# Altium schematic sheet 25.SchDoc
size 513 x 386 mm
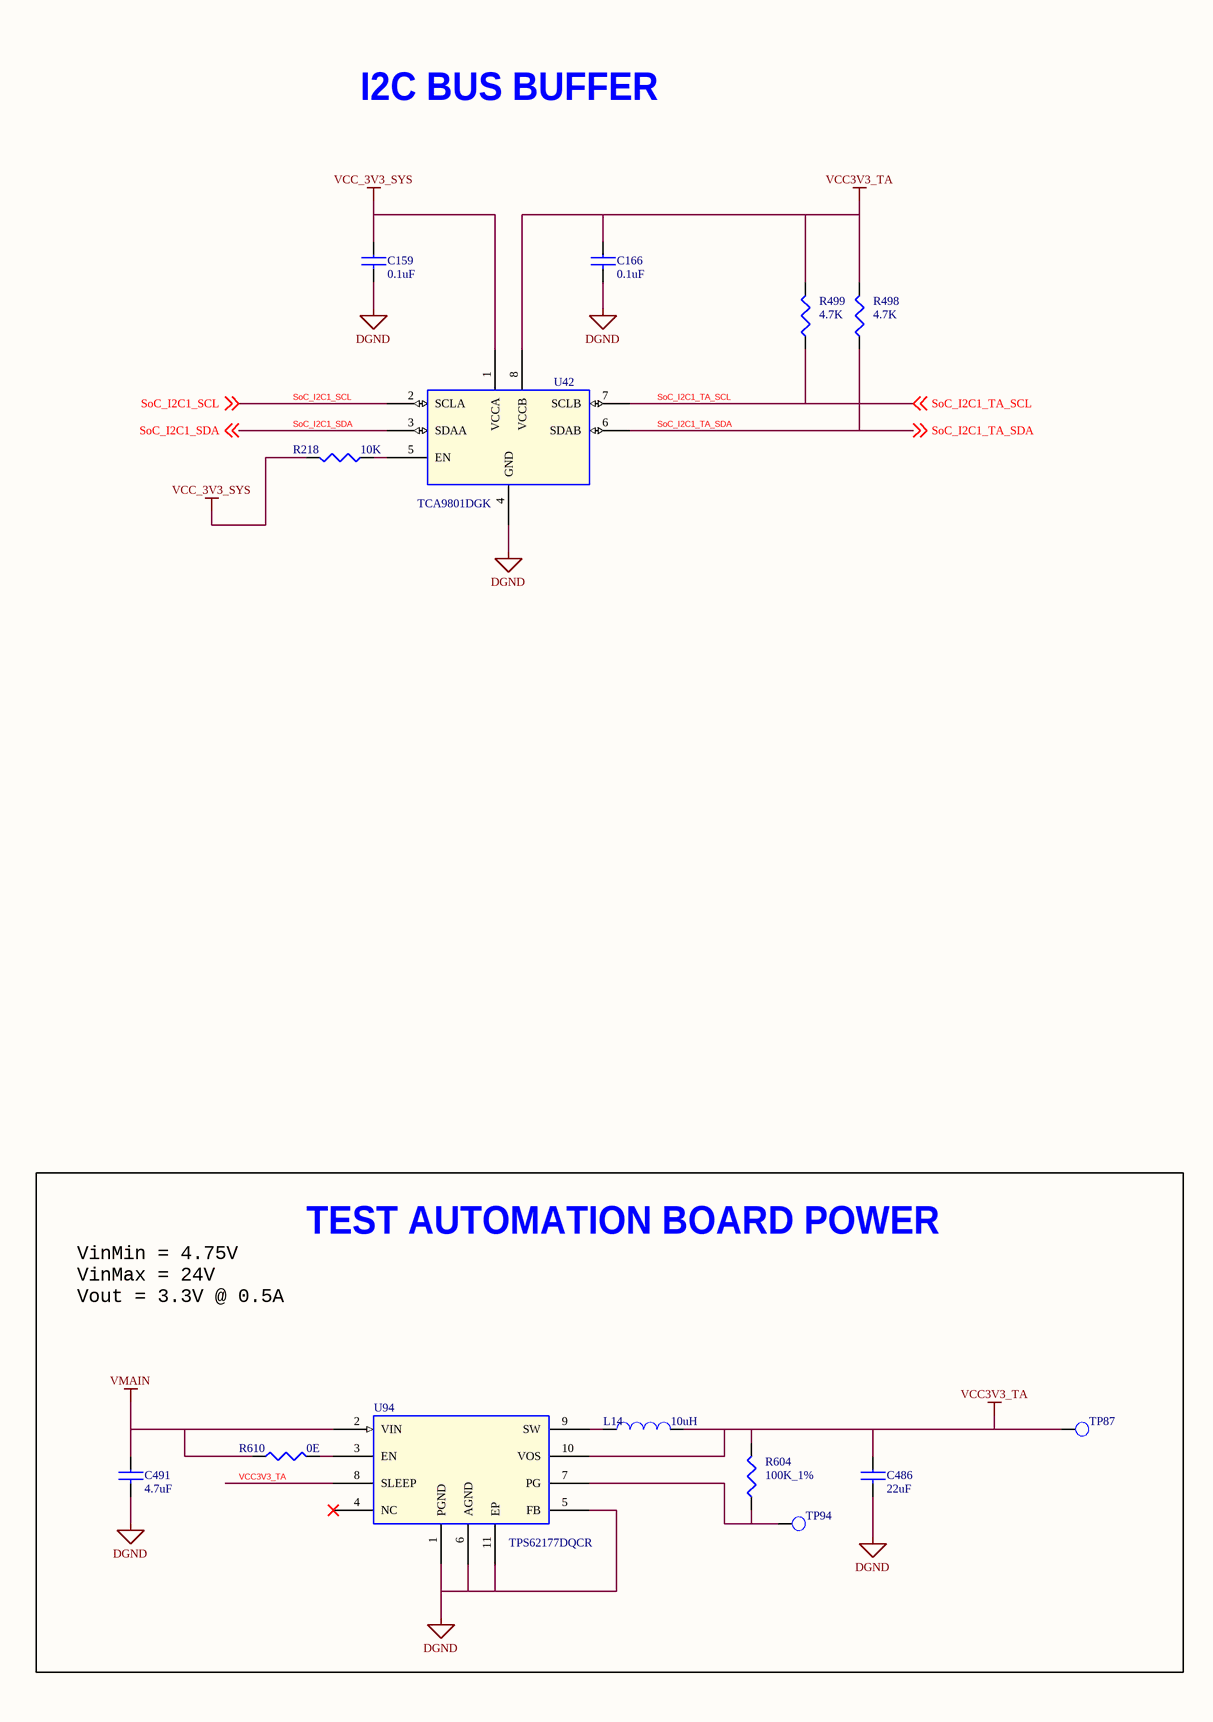
[diagram p0: 25.SchDoc, left]
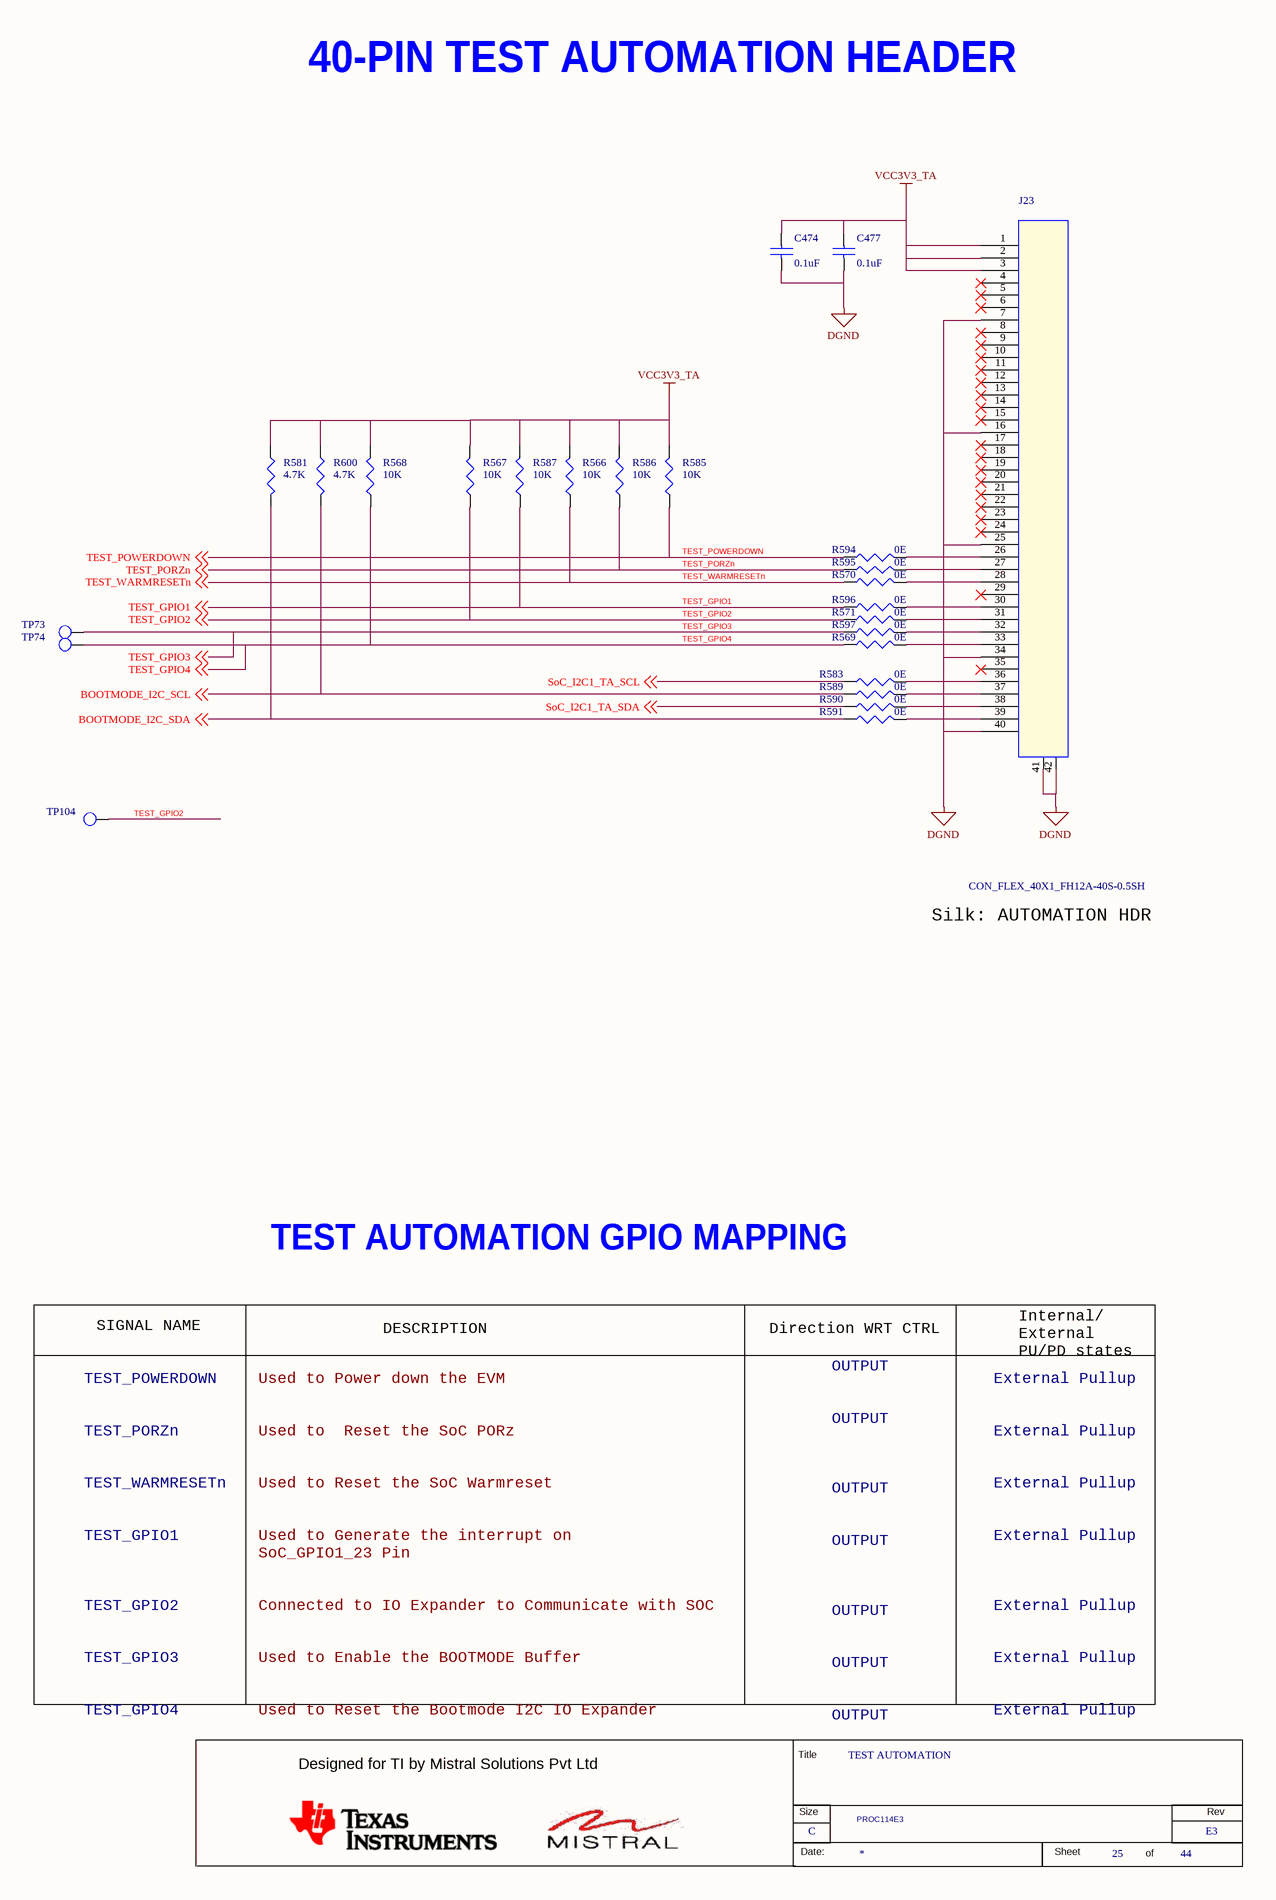
[diagram p1: 25.SchDoc, right]

## Parts
*  RevCode: E3  Title: TEST AUTOMATION  Page Size: C  Page Number: 25  Page Count: 44  Variant Name: PROC114E3  (hidden comment: MISTRAL_TITLEBLK_CSIZE)  (graphical)
C159  0.1uF  [CAP0201_0-5]
C166  0.1uF  [CAP0201_0-5]
C474  0.1uF  [CAP0201_0-5]
C477  0.1uF  [CAP0201_0-5]
C486  22uF  [CAP0603_1]
C491  4.7uF  [CAP0603_1]
J23  CON_FLEX_40X1_FH12A-40S-0.5SH  [CON_FLEX40X1_FH12A_S_R_S]
L14  10uH  [IND_1277AS-H_130X110_SMD_1-2]
R218  10K  [RES0201_0-5]
R498  4.7K  [RES0201_0-5]
R499  4.7K  [RES0201_0-5]
R566  10K  [RES0201_0-5]
R567  10K  [RES0201_0-5]
R568  10K  [RES0201_0-5]
R569  0E  [RES0402_0-5]
R570  0E  [RES0402_0-5]
R571  0E  [RES0402_0-5]
R581  4.7K  [RES0201_0-5]
R583  0E  [RES0402_0-5]
R585  10K  [RES0201_0-5]
R586  10K  [RES0201_0-5]
R587  10K  [RES0201_0-5]
R589  0E  [RES0402_0-5]
R590  0E  [RES0402_0-5]
R591  0E  [RES0402_0-5]
R594  0E  [RES0402_0-5]
R595  0E  [RES0402_0-5]
R596  0E  [RES0402_0-5]
R597  0E  [RES0402_0-5]
R600  4.7K  [RES0201_0-5]
R604  100K_1%  [RES0402_0-5]
R610  0E  [RES0402_0-5]
TP73  TP20_SMD  [TP20_SMD]  (value not drawn)
TP74  TP20_SMD  [TP20_SMD]  (value not drawn)
TP87  TP20_SMD  [TP20_SMD]  (value not drawn)
TP94  TP20_SMD  [TP20_SMD]  (value not drawn)
TP104  TP20_SMD  [TP20_SMD]  (value not drawn)
U42  TCA9801DGK  [VSSOP8_25-59_120X120_1-1]
U94  TPS62177DQCR  [WSON10_19-68_80X120_0-8]

## Blocks framed on the sheet
TEST AUTOMATION BOARD POWER: C486 C491 L14 R604 R610 TP87 TP94 U94

## Nets
DGND: C159.2 C166.2 C474.2 C477.2 C486.2 C491.2 J23.7 J23.16 J23.25 J23.34 J23.40 J23.41 J23.42 U42.4(GND) U94.1(PGND) U94.5(FB) U94.6(AGND) U94.11(EP)
VCC3V3_TA: C166.1 C474.1 C477.1 C486.1 J23.1 J23.2 J23.3 L14.2 R498.1 R499.1 R566.2 R567.2 R568.2 R581.1 R585.2 R586.2 R587.2 R600.1 R604.2 TP87.1(TP) U42.8(VCCB) U94.8(SLEEP) U94.10(VOS)
VCC_3V3_SYS: C159.1 R218.1 U42.1(VCCA)
VMAIN: C491.1 R610.1 U94.2(VIN)
BOOTMODE_I2C_SCL: R589.1 R600.2 ; off-sheet BOOTMODE_I2C_SCL
BOOTMODE_I2C_SDA: R581.2 R591.1 ; off-sheet BOOTMODE_I2C_SDA
SoC_I2C1_SCL: U42.2(SCLA) ; off-sheet SoC_I2C1_SCL
SoC_I2C1_SDA: U42.3(SDAA) ; off-sheet SoC_I2C1_SDA
SoC_I2C1_TA_SCL: R499.2 R583.1 U42.7(SCLB) ; off-sheet SoC_I2C1_TA_SCL
SoC_I2C1_TA_SDA: R498.2 R590.1 U42.6(SDAB) ; off-sheet SoC_I2C1_TA_SDA
TEST_GPIO1: R587.1 R596.1 ; off-sheet TEST_GPIO1
TEST_GPIO2: R567.1 R571.1 TP104.1(TP) ; off-sheet TEST_GPIO2
TEST_GPIO3: R597.1 TP73.1(TP) ; off-sheet TEST_GPIO3
TEST_GPIO4: R568.1 R569.1 TP74.1(TP) ; off-sheet TEST_GPIO4
TEST_PORZn: R586.1 R595.1 ; off-sheet TEST_PORZn
TEST_POWERDOWN: R585.1 R594.1 ; off-sheet TEST_POWERDOWN
TEST_WARMRESETn: R566.1 R570.1 ; off-sheet TEST_WARMRESETn
NetJ23_26: J23.26 R594.2
NetJ23_27: J23.27 R595.2
NetJ23_28: J23.28 R570.2
NetJ23_30: J23.30 R596.2
NetJ23_31: J23.31 R571.2
NetJ23_32: J23.32 R597.2
NetJ23_33: J23.33 R569.2
NetJ23_36: J23.36 R583.2
NetJ23_37: J23.37 R589.2
NetJ23_38: J23.38 R590.2
NetJ23_39: J23.39 R591.2
NetL14_1: L14.1 U94.9(SW)
NetR218_2: R218.2 U42.5(EN)
NetR604_1: R604.1 TP94.1(TP) U94.7(PG)
NetR610_2: R610.2 U94.3(EN)

Not connected (* = marked no-connect by the designer): J23 4* 5* 6* 8* 9* 10* 11* 12* 13* 14* 15* 17* 18* 19* 20* 21* 22* 23* 24* 29* 35*; U94 4(NC)*

## Notes on the sheet
- 40-PIN TEST AUTOMATION HEADER
- I2C BUS BUFFER
- Silk: AUTOMATION HDR
- TEST AUTOMATION GPIO MAPPING
- VinMin = 4.75V
  VinMax = 24V
  Vout = 3.3V @ 0.5A
- SIGNAL NAME
- DESCRIPTION
- Direction WRT CTRL
- Internal/
  External
  PU/PD states
- (near *) TEST_POWERDOWN
  TEST_PORZn
  TEST_WARMRESETn
  TEST_GPIO1
  TEST_GPIO2
  TEST_GPIO3
  TEST_GPIO4
- Used to Power down the EVM
  Used to  Reset the SoC PORz
  Used to Reset the SoC Warmreset
  Used to Generate the interrupt on
  SoC_GPIO1_23 Pin
  Connected to IO Expander to Communicate with SOC
  Used to Enable the BOOTMODE Buffer
  Used to Reset the Bootmode I2C IO Expander
- OUTPUT
  OUTPUT
  OUTPUT
  OUTPUT
  OUTPUT
  OUTPUT
  OUTPUT
- External Pullup
  External Pullup
  External Pullup
  External Pullup
  External Pullup
  External Pullup
  External Pullup
- (in symbol MISTRAL_TITLEBLK_CSIZE) Title; Designed for TI by Mistral Solutions Pvt Ltd; Size; Rev; Date:; Sheet; of

## Library data of the parts
* = MISTRAL_TITLEBLK_CSIZE: Issue: 1.0; Page Create Date: March  8, 1995; Page Modify Date: *; Schematic Page Count: 44; Schematic Page Number: 25
C159 C166 C477 = CAP_Dup2: CAP CERAMIC 0.1uF 16V 10% X5R 0201; Alt_Mfr_part_number: CC0402KRX5R8BB104; Mistral Part No: 120009030072-R; Mfr_name: MURATA; Mfr_part_number: GRM033R61C104KE14D; Part_type: CAPACITORS\CERAMIC; Alt_Mfr_name: YAGEO AMERICA; Project: TI_MAXIE_CPB; Wattage: NA; Customs_HS_Code: 85322990; Custom_Duty: 15%; PCB Footprint: CAP0201_0-5; Tolerance: 10%; Voltage: 16V; Package: 0201; Distributor_name: DIGIKEY; Distributor_part_number: 490-14305-1-ND; Height: 0.33MM; Weight: 0.33mg; Temperature: -55°C+85°C; Datasheet: Y:\MIS_DATABASE\DATASHEETS\CAPACITORS\GRM033R61C104KE14.PDF; Crtd /date: MANIRAJA/230118; Chkd/date: MANIRAJA/230118; MECHANICAL 3D STEP FILE: CAP0201_0-5; Library Ref: CAP; Footprint Ref: CAP0201_0-5; Library Path: Y:\MIS_DATABASE\Library\ALTIUM_TOOL\SCHEMATICS_PARTS\MS_DISCRETE_Library.schlib; Footprint Path: Y:\MIS_DATABASE\Library\ALTIUM_TOOL\PCB_FOOTPRINTS\Altium_Footprint_Lib.PcbLib
C474 = CAP_Dup2: CAP CERAMIC 0.1uF 16V 10% X5R 0201; Alt_Mfr_name: YAGEO AMERICA; Part_type: CAPACITORS\CERAMIC; Mfr_part_number: GRM033R61C104KE14D; Mfr_name: MURATA; Mistral Part No: 120009030072-R; Alt_Mfr_part_number: CC0402KRX5R8BB104; Custom_Duty: 15%; Customs_HS_Code: 85322990; Wattage: NA; Project: TI_MAXIE_CPB; Footprint Path: Y:\MIS_DATABASE\Library\ALTIUM_TOOL\PCB_FOOTPRINTS\Altium_Footprint_Lib.PcbLib; Library Path: Y:\MIS_DATABASE\Library\ALTIUM_TOOL\SCHEMATICS_PARTS\MS_DISCRETE_Library.schlib; Footprint Ref: CAP0201_0-5; Library Ref: CAP; MECHANICAL 3D STEP FILE: CAP0201_0-5; Chkd/date: MANIRAJA/230118; Crtd /date: MANIRAJA/230118; Datasheet: Y:\MIS_DATABASE\DATASHEETS\CAPACITORS\GRM033R61C104KE14.PDF; Temperature: -55°C+85°C; Weight: 0.33mg; Height: 0.33MM; Distributor_part_number: 490-14305-1-ND; Distributor_name: DIGIKEY; Package: 0201; Voltage: 16V; Tolerance: 10%; PCB Footprint: CAP0201_0-5
C486 = CAP_Dup2: CAP CERAMIC 22uF 10V 20% X5R 0603; Part_type: CAPACITORS\CERAMIC; Mfr_part_number: GRM188R61A226ME15D; Mfr_name: MURATA; Mistral Part No: 120014100009-R; Custom_Duty: 15%; Customs_HS_Code: 85322990; Wattage: NA; Project: TI_MAXIE_CPB; Footprint Path: Y:\MIS_DATABASE\Library\ALTIUM_TOOL\PCB_FOOTPRINTS\Altium_Footprint_Lib.PcbLib; Library Path: Y:\MIS_DATABASE\Library\ALTIUM_TOOL\SCHEMATICS_PARTS\MS_DISCRETE_Library.schlib; Footprint Ref: CAP0603_1; MECHANICAL 3D STEP FILE: CAP0603_1; Chkd/date: MANIRAJA/230118; Crtd /date: MANIRAJA/230118; Datasheet: Y:\MIS_DATABASE\DATASHEETS\CAPACITORS\GRM188R61A226ME15.PDF; Temperature: -55°C+85°C; Weight: 6.3mg; Height: 1.00MM; Library Ref: CAP; Distributor_part_number: 490-10476-1-ND; Distributor_name: DIGIKEY; Package: 0603; Voltage: 10V; Tolerance: 20%; PCB Footprint: CAP0603_1
C491 = CAP: CAP CERAMIC 4.7uF 35V 20% X5R 0603; Mistral Part No: 120020050017-R; Mfr_name: MURATA; Mfr_part_number: GRM188R6YA475ME15D; Part_type: CAPACITORS\CERAMIC; Project: SD865_NANOSOM; Wattage: NA; Customs_HS_Code: 85322990; Custom_Duty: 15%; Footprint Ref: CAP0603_1; Tolerance: 20%; Voltage: 35V; Package: 0603; Distributor_name: DIGIKEY; Distributor_part_number: 490-11995-1-ND; Library Ref: CAP; Height: 1.00MM; Weight: 6.3mg; Temperature: -55°C+85°C; Datasheet: Y:\MIS_DATABASE\DATASHEETS\CAPACITORS\GRM188R6YA475ME15.PDF; Crtd /date: ALVY/120520; Chkd/date: MANIRAJA/120520; MECHANICAL 3D STEP FILE: CAP0603_1; Library Path: Y:\MIS_DATABASE\Library\ALTIUM_TOOL\SCHEMATICS_PARTS\MS_DISCRETE_Library.schlib; Footprint Path: Y:\MIS_DATABASE\Library\ALTIUM_TOOL\PCB_FOOTPRINTS\Altium_Footprint_Lib.PcbLib; PCB Footprint: CAP0603_1
J23 = CON_FLEX_40X1_FH12A-40S-0.5SH: CON FPC 40X1 0.50MM PITCH RT TOP SMD; Mistral Part No: 150009030176-R; Mfr_name: HIROSE ELECTRIC EUROPE; Mfr_part_number: FH12A-40S-0.5SH(55); Part_type: CONNECTOR\FPC; Project: PMP LCD BOARD; Customs_HS_Code: 85369090; Custom_Duty: 24%; Package: SMD; Distributor_name: DIGIKEY; Distributor_part_number: HFK40CT-ND; Height: 2.00MM; Datasheet: Y:\MIS_DATABASE\DATASHEETS\CONNECTORS\FH12SERIES.PDF; Crtd /date: MAZHAR/171106; Chkd/date: SHREESHAIL/201106; Library Ref: CON_FLEX_40X1_FH12A-40S-0.5SH; PCB Footprint: CON_FLEX40X1_FH12A_S_R_S
L14 = INDUCTOR: IND POWER 10uH 900mA 20% SMD; Mfr_part_number: 1277AS-H-100M=P2; Mfr_name: MURATA; Mistral Part No: 130021090022-R; Custom_Duty: 24%; Customs_HS_Code: 85369090; Wattage: NA; Project: TI_AM62x SKEVM_BRD; MECHANICAL 3D STEP FILE: IND_1277AS-H_130X110_SMD_1-2; Chkd/date: MANIRAJA/200921; Crtd /date: ALVY/200921; Datasheet: Y:\MIS_DATABASE\DATASHEETS\DISCRETES\INDUCTORS\MURATA-1277AS-H.PDF; Temperature: -40°C+85°C; Weight: NA; Height: 1.20MM; Library Ref: INDUCTOR; Distributor_part_number: 490-10589-1-ND; Distributor_name: DIGIKEY; Package: SMD; Voltage: NA; Tolerance: 20%; Part_type: INDUCTOR; Footprint Ref: IND_1277AS-H_130X110_SMD_1-2; Library Path: Y:\MIS_DATABASE\Library\ALTIUM_TOOL\SCHEMATICS_PARTS\MS_DISCRETE_Library.schlib; Footprint Path: Y:\MIS_DATABASE\Library\ALTIUM_TOOL\PCB_FOOTPRINTS\Altium_Footprint_Lib.PcbLib; PCB Footprint: IND_1277AS-H_130X110_SMD_1-2
R218 R568 = RESISTOR_Dup6: RES 10K 1/20W 5% 0201; Part_type: RESISTORS\FIXED; Mfr_part_number: RC0201JR-0710KL; Mfr_name: YAGEO AMERICA; Mistral Part No: 110010070051-R; Custom_Duty: 15%; Customs_HS_Code: 85332119; Voltage: NA; Project: GOLDEN-I LITE; MECHANICAL 3D STEP FILE: RES0201_0-5; Chkd/date: MANIRAJA/050517; Crtd /date: MANIRAJA/050517; Datasheet: Y:\MIS_DATABASE\DATASHEETS\RESISTORS\RCXXXXL-SER_MAR18.PDF; Temperature: -55°C+125°C; Weight: 0.17mg; Height: 0.26MM; Distributor_part_number: 311-10KNCT-ND; Distributor_name: DIGIKEY; Package: 0201; Wattage: 1/20W; Tolerance: 5%; Library Ref: RESISTOR; Footprint Ref: RES0201_0-5; Library Path: Y:\MIS_DATABASE\Library\ALTIUM_TOOL\SCHEMATICS_PARTS\MS_DISCRETE_Library.schlib; Footprint Path: Y:\MIS_DATABASE\Library\ALTIUM_TOOL\PCB_FOOTPRINTS\Altium_Footprint_Lib.PcbLib; PCB Footprint: RES0201_0-5
R498 R499 R581 = RESISTOR_Dup6: RES 4.7K 1/20W 5% 0201; Part_type: RESISTORS\FIXED; Mfr_part_number: RC0201JR-074K7L; Mfr_name: YAGEO AMERICA; Mistral Part No: 110021090007-R; Custom_Duty: 15%; Customs_HS_Code: 85332119; Voltage: NA; Project: TI_AM62x SKEVM_BRD; PCB Footprint: RES0201_0-5; Footprint Path: Y:\MIS_DATABASE\Library\ALTIUM_TOOL\PCB_FOOTPRINTS\Altium_Footprint_Lib.PcbLib; Library Path: Y:\MIS_DATABASE\Library\ALTIUM_TOOL\SCHEMATICS_PARTS\MS_DISCRETE_Library.schlib; MECHANICAL 3D STEP FILE: RES0201_0-5; Chkd/date: MANIRAJA/200921; Crtd /date: ALVY/200921; Datasheet: Y:\MIS_DATABASE\DATASHEETS\RESISTORS\RCXXXXL-SER_MAR18.PDF; Temperature: -55°C+125°C; Weight: 0.17mg; Height: 0.26MM; Library Ref: RESISTOR; Distributor_part_number: 311-4.7KNCT-ND; Distributor_name: DIGIKEY; Package: 0201; Wattage: 1/20W; Tolerance: 5%; Footprint Ref: RES0201_0-5
R566 R567 R585-R587 = RESISTOR_Dup6: RES 10K 1/20W 5% 0201; Mistral Part No: 110010070051-R; Mfr_name: YAGEO AMERICA; Mfr_part_number: RC0201JR-0710KL; Part_type: RESISTORS\FIXED; Project: GOLDEN-I LITE; Voltage: NA; Customs_HS_Code: 85332119; Custom_Duty: 15%; Footprint Path: Y:\MIS_DATABASE\Library\ALTIUM_TOOL\PCB_FOOTPRINTS\Altium_Footprint_Lib.PcbLib; Library Path: Y:\MIS_DATABASE\Library\ALTIUM_TOOL\SCHEMATICS_PARTS\MS_DISCRETE_Library.schlib; Footprint Ref: RES0201_0-5; Library Ref: RESISTOR; Tolerance: 5%; Wattage: 1/20W; Package: 0201; Distributor_name: DIGIKEY; Distributor_part_number: 311-10KNCT-ND; Height: 0.26MM; Weight: 0.17mg; Temperature: -55°C+125°C; Datasheet: Y:\MIS_DATABASE\DATASHEETS\RESISTORS\RCXXXXL-SER_MAR18.PDF; Crtd /date: MANIRAJA/050517; Chkd/date: MANIRAJA/050517; MECHANICAL 3D STEP FILE: RES0201_0-5; PCB Footprint: RES0201_0-5
R569 R571 R596 R597 = RESISTOR_Dup6: RES 0E 1/16W JUMPER 0402; Mistral Part No: 110010080019-R; Mfr_name: VISHAY; Mfr_part_number: CRCW04020000Z0ED; Part_type: RESISTORS\FIXED; Project: PB_BUGBASE; Tolerance: NA; Customs_HS_Code: 85332119; Custom_Duty: 15%; Footprint Ref: RES0402_0-5; Voltage: NA; Wattage: 1/16W; Package: 0402; Distributor_name: DIGIKEY; Distributor_part_number: 541-0.0JCT-ND; Library Ref: RESISTOR; Height: 0.40MM; Weight: 0.65mg; Temperature: -55°C+155°C; Datasheet: Y:\MIS_DATABASE\DATASHEETS\RESISTORS\CRCW0603.PDF; Crtd /date: MUDDU/190810; Chkd/date: VASANTHA/201216; MECHANICAL 3D STEP FILE: RES0402_0-5; Library Path: Y:\MIS_DATABASE\Library\ALTIUM_TOOL\SCHEMATICS_PARTS\MS_DISCRETE_Library.schlib; Footprint Path: Y:\MIS_DATABASE\Library\ALTIUM_TOOL\PCB_FOOTPRINTS\Altium_Footprint_Lib.PcbLib; PCB Footprint: RES0402_0-5
R570 R583 R589-R591 R594 R595 = RESISTOR_Dup6: RES 0E 1/16W JUMPER 0402; Part_type: RESISTORS\FIXED; Mfr_part_number: CRCW04020000Z0ED; Mfr_name: VISHAY; Mistral Part No: 110010080019-R; Custom_Duty: 15%; Customs_HS_Code: 85332119; Voltage: NA; Project: PB_BUGBASE; Footprint Path: Y:\MIS_DATABASE\Library\ALTIUM_TOOL\PCB_FOOTPRINTS\Altium_Footprint_Lib.PcbLib; Library Path: Y:\MIS_DATABASE\Library\ALTIUM_TOOL\SCHEMATICS_PARTS\MS_DISCRETE_Library.schlib; MECHANICAL 3D STEP FILE: RES0402_0-5; Chkd/date: VASANTHA/201216; Crtd /date: MUDDU/190810; Datasheet: Y:\MIS_DATABASE\DATASHEETS\RESISTORS\CRCW0603.PDF; Temperature: -55°C+155°C; Weight: 0.65mg; Height: 0.40MM; Library Ref: RESISTOR; Distributor_part_number: 541-0.0JCT-ND; Distributor_name: DIGIKEY; Package: 0402; Wattage: 1/16W; Tolerance: NA; Footprint Ref: RES0402_0-5; PCB Footprint: RES0402_0-5
R600 = RESISTOR_Dup6: RES 4.7K 1/20W 5% 0201; Mistral Part No: 110021090007-R; Mfr_name: YAGEO AMERICA; Mfr_part_number: RC0201JR-074K7L; Part_type: RESISTORS\FIXED; Project: TI_AM62x SKEVM_BRD; Voltage: NA; Customs_HS_Code: 85332119; Custom_Duty: 15%; Footprint Ref: RES0201_0-5; Tolerance: 5%; Wattage: 1/20W; Package: 0201; Distributor_name: DIGIKEY; Distributor_part_number: 311-4.7KNCT-ND; Library Ref: RESISTOR; Height: 0.26MM; Weight: 0.17mg; Temperature: -55°C+125°C; Datasheet: Y:\MIS_DATABASE\DATASHEETS\RESISTORS\RCXXXXL-SER_MAR18.PDF; Crtd /date: ALVY/200921; Chkd/date: MANIRAJA/200921; MECHANICAL 3D STEP FILE: RES0201_0-5; Library Path: Y:\MIS_DATABASE\Library\ALTIUM_TOOL\SCHEMATICS_PARTS\MS_DISCRETE_Library.schlib; Footprint Path: Y:\MIS_DATABASE\Library\ALTIUM_TOOL\PCB_FOOTPRINTS\Altium_Footprint_Lib.PcbLib; PCB Footprint: RES0201_0-5
R604 = RESISTOR_Dup6: RES 100K 1/10W 1% 0402; Part_type: RESISTORS\FIXED; Mfr_part_number: ERJ-2RKF1003X; Mfr_name: PANASONIC-ECG; Mistral Part No: 110009030187-R; Custom_Duty: 15%; Customs_HS_Code: 85332119; Voltage: NA; Project: J32; MECHANICAL 3D STEP FILE: RES0402_0-5; Chkd/date: VASANTHA/201216; Crtd /date: MAZHAR/130306; Datasheet: Y:\MIS_DATABASE\DATASHEETS\RESISTORS\PAN-ERJSER_NOV17.PDF; Temperature: -55°C+155°C; Weight: 0.8mg; Height: 0.40MM; Distributor_part_number: P100KLCT-ND; Distributor_name: DIGIKEY; Package: 0402; Wattage: 1/10W; Tolerance: 1%; Library Ref: RESISTOR; Footprint Ref: RES0402_0-5; Library Path: Y:\MIS_DATABASE\Library\ALTIUM_TOOL\SCHEMATICS_PARTS\MS_DISCRETE_Library.schlib; Footprint Path: Y:\MIS_DATABASE\Library\ALTIUM_TOOL\PCB_FOOTPRINTS\Altium_Footprint_Lib.PcbLib; PCB Footprint: RES0402_0-5
R610 = RESISTOR_Dup4: RES 0E 1/16W JUMPER 0402; Part_type: RESISTORS\FIXED; Mfr_part_number: CRCW04020000Z0ED; Mfr_name: VISHAY; Mistral Part No: 110010080019-R; Custom_Duty: 15%; Customs_HS_Code: 85332119; Voltage: NA; Project: PB_BUGBASE; Footprint Path: Y:\MIS_DATABASE\Library\ALTIUM_TOOL\PCB_FOOTPRINTS\Altium_Footprint_Lib.PcbLib; Library Path: Y:\MIS_DATABASE\Library\ALTIUM_TOOL\SCHEMATICS_PARTS\MS_DISCRETE_Library.schlib; Footprint Ref: RES0402_0-5; Library Ref: RESISTOR; Chkd/date: VASANTHA/201216; Crtd /date: MUDDU/190810; Datasheet: Y:\MIS_DATABASE\DATASHEETS\RESISTORS\CRCW0603.PDF; Temperature: -55°C+155°C; Weight: 0.65mg; Height: 0.40MM; Distributor_part_number: 541-0.0JCT-ND; Distributor_name: DIGIKEY; Package: 0402; Wattage: 1/16W; Tolerance: NA; MECHANICAL 3D STEP FILE: RES0402_0-5; PCB Footprint: RES0402_0-5
TP73 = TESTPOINT: TESTPOINT CIR 20 SMD; Mfr_name: LOCAL; Custom_Duty: NA; Project: BT MODULE_CSRBC04; Customs_HS_Code: NA; RoHS: NA; Footprint Ref: TP20_SMD; Library Ref: TESTPOINT; Mistral Part No: NA; Mfr_part_number: TP20_SMD; Part_type: TESTPOINT; Package: SMD; Distributor_name: NA; Distributor_part_number: NA; Height: NA; Crtd /date: MAZHAR/171006; Chkd/date: SHREESHAIL/171006; Tolerance: NA; Voltage: NA; Wattage: NA; Weight: NA; Temperature: NA; Datasheet: NA; MECHANICAL 3D STEP FILE: NA; Library Path: Y:\MIS_DATABASE\Library\ALTIUM_TOOL\SCHEMATICS_PARTS\MS_DISCRETE_Library.schlib; Footprint Path: Y:\MIS_DATABASE\Library\ALTIUM_TOOL\PCB_FOOTPRINTS\Altium_Footprint_Lib.PcbLib; PCB Footprint: TP20_SMD
TP74 TP94 TP104 = TESTPOINT: TESTPOINT CIR 20 SMD; Mfr_name: LOCAL; MECHANICAL 3D STEP FILE: NA; Project: BT MODULE_CSRBC04; Footprint Path: Y:\MIS_DATABASE\Library\ALTIUM_TOOL\PCB_FOOTPRINTS\Altium_Footprint_Lib.PcbLib; Library Path: Y:\MIS_DATABASE\Library\ALTIUM_TOOL\SCHEMATICS_PARTS\MS_DISCRETE_Library.schlib; Datasheet: NA; Temperature: NA; Weight: NA; Wattage: NA; Voltage: NA; Tolerance: NA; Chkd/date: SHREESHAIL/171006; Crtd /date: MAZHAR/171006; Height: NA; Distributor_part_number: NA; Distributor_name: NA; Package: SMD; Part_type: TESTPOINT; Mfr_part_number: TP20_SMD; Mistral Part No: NA; Library Ref: TESTPOINT; Footprint Ref: TP20_SMD; RoHS: NA; Customs_HS_Code: NA; Custom_Duty: NA; PCB Footprint: TP20_SMD
TP87 = TESTPOINT: TESTPOINT CIR 20 SMD; Mistral Part No: NA; Mfr_name: LOCAL; Project: BT MODULE_CSRBC04; RoHS: NA; Footprint Ref: TP20_SMD; Library Ref: TESTPOINT; Mfr_part_number: TP20_SMD; Part_type: TESTPOINT; Package: SMD; Distributor_name: NA; Distributor_part_number: NA; Height: NA; Crtd /date: MAZHAR/171006; Chkd/date: SHREESHAIL/171006; Tolerance: NA; Voltage: NA; Wattage: NA; Weight: NA; Temperature: NA; Datasheet: NA; MECHANICAL 3D STEP FILE: NA; Library Path: Y:\MIS_DATABASE\Library\ALTIUM_TOOL\SCHEMATICS_PARTS\MS_DISCRETE_Library.schlib; Footprint Path: Y:\MIS_DATABASE\Library\ALTIUM_TOOL\PCB_FOOTPRINTS\Altium_Footprint_Lib.PcbLib; Customs_HS_Code: NA; Custom_Duty: NA; PCB Footprint: TP20_SMD
U42 = TCA9801DGK_VSSOP8: IC LEVEL TRANSLATING I2C BUS BUFFER/REPEATER VSSOP8; Mistral Part No: 141018070002-R; Mfr_name: TEXAS INSTRUMENTS; Mfr_part_number: TCA9801DGKT; Part_type: ICS\INTERFACE\LEVEL TRANSLATOR; Project: DARE_RFAM_RF; Tolerance: NA; Customs_HS_Code: 85423100; Custom_Duty: 15%; Footprint Ref: VSSOP8_25-59_120X120_1-1; Voltage: NA; Wattage: NA; Package: VSSOP8; Distributor_name: DIGIKEY; Distributor_part_number: 296-46571-1-ND; Library Ref: TCA9801DGK_VSSOP8; Height: 1.10MM; Weight: 20mg; Temperature: -40°C+85°C; Datasheet: Y:\MIS_DATABASE\DATASHEETS\ICS\INTERFACE\TCA9801DGK.PDF; Crtd /date: MANIRAJA/020718; Chkd/date: MANIRAJA/020718; MECHANICAL 3D STEP FILE: VSSOP8_25-59_120X120_1-1; Library Path: Y:\MIS_DATABASE\Library\ALTIUM_TOOL\SCHEMATICS_PARTS\MS_MISCINTERFACE_Library.schlib; Footprint Path: Y:\MIS_DATABASE\Library\ALTIUM_TOOL\PCB_FOOTPRINTS\Altium_Footprint_Lib.PcbLib; PCB Footprint: VSSOP8_25-59_120X120_1-1
U94 = TPS62177_WSON10: IC 3.3V 0.5A STEP DOWN CONVERTER WITH SLEEP MODE WSON10; Part_type: ICS\POWER\DC-DC CONVERTER; Mfr_name: TEXAS INSTRUMENTS; Mistral Part No: 142019070007-R; Custom_Duty: 15%; Customs_HS_Code: 85423100; Wattage: NA; Project: TI_MAXIE_CPB; Footprint Path: Y:\MIS_DATABASE\Library\ALTIUM_TOOL\PCB_FOOTPRINTS\Altium_Footprint_Lib.PcbLib; Library Path: Y:\MIS_DATABASE\Library\ALTIUM_TOOL\SCHEMATICS_PARTS\MS_MISCPOWER_Library.schlib; MECHANICAL 3D STEP FILE: WSON10_19-68_80X120_0-8; Chkd/date: MANIRAJA/170719; Crtd /date: MANIRAJA/170719; Datasheet: Y:\MIS_DATABASE\DATASHEETS\ICS\POWER\TPS62177.PDF; Temperature: -40°C+85°C; Weight: 15mg; Height: 0.80MM; Footprint Ref: WSON10_19-68_80X120_0-8; Library Ref: TPS62177_WSON10; Distributor_part_number: 296-41856-1-ND; Distributor_name: DIGIKEY; Package: WSON10; Voltage: NA; Tolerance: NA; Mfr_part_number: TPS62177DQCR; PCB Footprint: WSON10_19-68_80X120_0-8